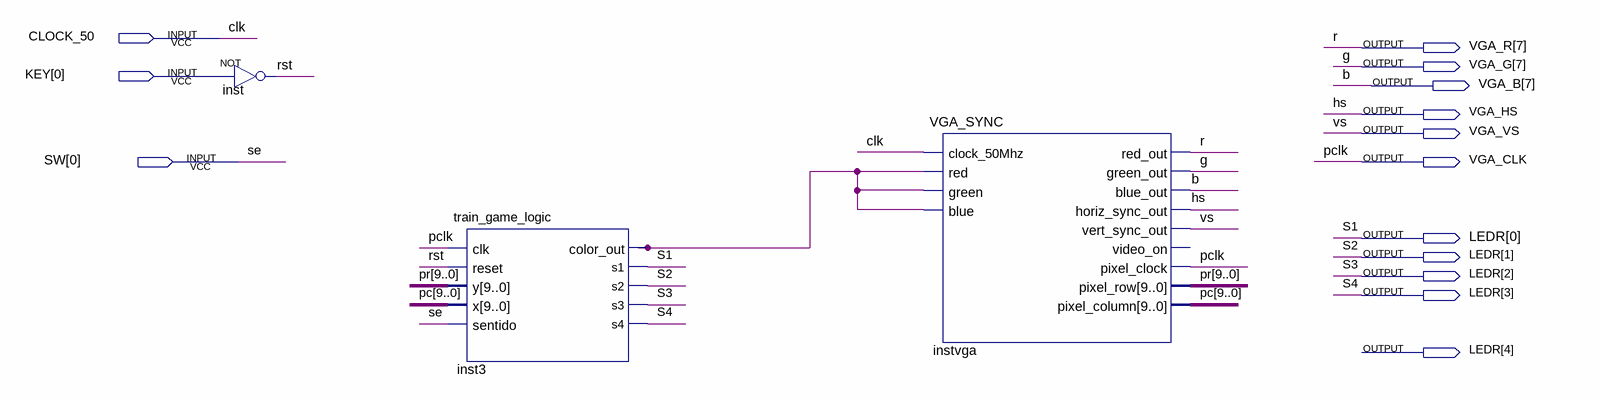
[diagram p0: schematic sheet]
// Quartus schematic Block1.bdf as structural Verilog: 3 symbols, 14 pins
module Block1 (
  input  CLOCK_50,
  input  [0:0] KEY,
  input  [0:0] SW,
  output [7:7] VGA_R,
  output [7:7] VGA_G,
  output [7:7] VGA_B,
  output VGA_HS,
  output VGA_VS,
  output VGA_CLK,
  output [4:0] LEDR
);

  wire inst3_color_out, rst;
  wire [9:0] pc, pr;

  not inst (rst, KEY[0]);
  train_game_logic inst3 (
    .clk(VGA_CLK), .reset(rst), .y(pr), .x(pc), .sentido(SW[0]), .color_out(inst3_color_out), .s1(LEDR[0]),
    .s2(LEDR[1]), .s3(LEDR[2]), .s4(LEDR[3]));
  VGA_SYNC instvga (
    .clock_50Mhz(CLOCK_50), .red(inst3_color_out), .green(inst3_color_out), .blue(inst3_color_out),
    .red_out(VGA_R[7]), .green_out(VGA_G[7]), .blue_out(VGA_B[7]), .horiz_sync_out(VGA_HS),
    .vert_sync_out(VGA_VS), .pixel_clock(VGA_CLK), .pixel_row(pr), .pixel_column(pc));  // open: video_on

  // Other names for the same wires on the sheet: b = VGA_B[7]; clk = CLOCK_50; g = VGA_G[7]; hs = VGA_HS;
  //   pclk = VGA_CLK; r = VGA_R[7]; S1 = LEDR[0]; S2 = LEDR[1]; S3 = LEDR[2]; S4 = LEDR[3]; se = SW[0]; vs = VGA_VS
endmodule
